# EAGLE design fab-slider-shield-v2_controls-only (EAGLE 9.2.0)
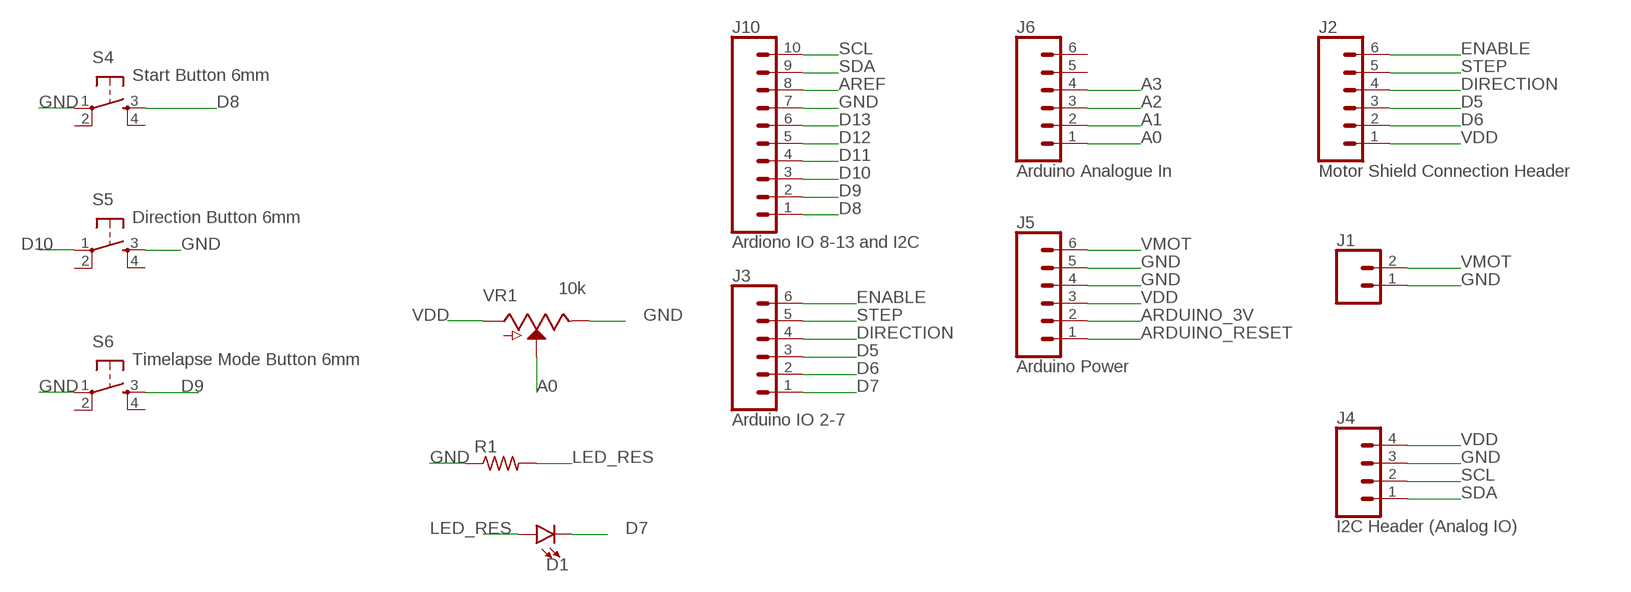
[diagram p0: schematic, sheet 1]

## Parts
D1  LED1206  [LED-1206]
J1  CONN_02PTH3  [1X02_LONGPADS]
J2  Motor Shield Connection Header  CONN_06LONGPADS  [1X06_LONGPADS]
J3  Arduino IO 2-7  CONN_06NO_SILK_FEMALE_PTH  [1X06_NO_SILK]
J4  I2C Header (Analog IO)  CONN_04  [1X04]
J5  Arduino Power  CONN_06NO_SILK_FEMALE_PTH  [1X06_NO_SILK]
J6  Arduino Analogue In  CONN_06NO_SILK_FEMALE_PTH  [1X06_NO_SILK]
J10  Ardiono IO 8-13 and I2C  CONN_10NO_SILK_PTH_FEMALE  [1X10_NO_SILK]
R1  RES-US1206FAB  [R1206FAB]
S4  Start Button 6mm  6MM_SWITCH6MM_SWITCH  [6MM_SWITCH]
S5  Direction Button 6mm  6MM_SWITCH6MM_SWITCH  [6MM_SWITCH]
S6  Timelapse Mode Button 6mm  6MM_SWITCH6MM_SWITCH  [6MM_SWITCH]
VR1  10k  POTENTIOMETER-PTH-9MM-1/20W-20%  [POT-PTH-ALPS]

## Nets
A0: J6.1 VR1.P$2(S)
A1: J6.2
A2: J6.3
A3: J6.4
ARDUINO_3V: J5.2
ARDUINO_RESET: J5.1
AREF: J10.8
D5: J2.3 J3.3
D6: J2.2 J3.2
D7: D1.C J3.1
D8: J10.1 S4.3(S)
D9: J10.2 S6.3(S)
D10: J10.3 S5.1(P)
D11: J10.4
D12: J10.5
D13: J10.6
DIRECTION: J2.4 J3.4
ENABLE: J2.6 J3.6
GND: J1.1 J4.3 J5.4 J5.5 J10.7 R1.1 S4.1(P) S5.3(S) S6.1(P) VR1.P$1(E)
LED_RES: D1.A R1.2
SCL: J4.2 J10.10
SDA: J4.1 J10.9
STEP: J2.5 J3.5
VDD: J2.1 J4.4 J5.3 VR1.P$3(A)
VMOT: J1.2 J5.6
Unconnected: J6.5 J6.6 S4.2(P1) S4.4(S1) S5.2(P1) S5.4(S1) S6.2(P1) S6.4(S1)

## Library data of the parts
D1 = SparkFun-LED:LED: LED (Generic) Standard schematic elements and footprints for 5mm, 3mm, 1206, and 0603 sized LEDs. Generic LEDs with no color specified.
J1 = SparkFun-Connectors:CONN_02: Multi connection point. Often used as Generic Header-pin footprint for 0.1 inch spaced/style header connections On any of the 0.1 inch spaced packages, you can populate with these: Break Away Headers - Straight <https://www.sparkfun.com/products/116> (PRT-00116) Break Away Male Headers - Right Angle <https://www.sparkfun.com/products/553> (PRT-00553) Female Headers <https://www.sparkfun.com/products/115> (PRT-00115) Break Away Headers - Machine Pin <https://www.sparkfun.com/products/117> (PRT-00117) Break Away Female Headers - Swiss Machine Pin <https://www.sparkfun.com/products/743> (PRT-00743) For SCREWTERMINALS and SPRING TERMINALS visit here: Screw Terimnals on SparkFun.com <https://www.sparkfun.com/search/results?term=Screw+Terminals> (5mm/3.5mm/2.54mm spacing) This device is also useful as a general connection point to wire up your design to another part of your project. Our various solder wires solder well into these plated through hole pads. Hook-Up Wire - Assortment (Stranded, 22 AWG) <https://www.sparkfun.com/products/11375> (PRT-11375) Hook-Up Wire - Assortment (Solid Core, 22 AWG) <https://www.sparkfun.com/products/11367> (PRT-11367) View the entire wire category on our website here <https://www.sparkfun.com/categories/141> Special notes: Molex polarized connector foot print use with: PRT-08233 with associated crimp pins and housings. 2.54_SCREWTERM for use with PRT-10571. 3.5mm Screw Terminal footprints for PRT-08084 5mm Screw Terminal footprints for use with PRT-08432
J2 = SparkFun-Connectors:CONN_06: Multi connection point. Often used as Generic Header-pin footprint for 0.1 inch spaced/style header connections On any of the 0.1 inch spaced packages, you can populate with these: Break Away Headers - Straight <https://www.sparkfun.com/products/116> (PRT-00116) Break Away Male Headers - Right Angle <https://www.sparkfun.com/products/553> (PRT-00553) Female Headers <https://www.sparkfun.com/products/115> (PRT-00115) Break Away Headers - Machine Pin <https://www.sparkfun.com/products/117> (PRT-00117) Break Away Female Headers - Swiss Machine Pin <https://www.sparkfun.com/products/743> (PRT-00743) Arduino Stackable Header - 6 Pin <https://www.sparkfun.com/products/9280> (PRT-09280) For SCREWTERMINALS and SPRING TERMINALS visit here: Screw Terimnals on SparkFun.com <https://www.sparkfun.com/search/results?term=Screw+Terminals> (5mm/3.5mm/2.54mm spacing) This device is also useful as a general connection point to wire up your design to another part of your project. Our various solder wires solder well into these plated through hole pads. Hook-Up Wire - Assortment (Stranded, 22 AWG) <https://www.sparkfun.com/products/11375> (PRT-11375) Hook-Up Wire - Assortment (Solid Core, 22 AWG) <https://www.sparkfun.com/products/11367> (PRT-11367) View the entire wire category on our website here <https://www.sparkfun.com/categories/141>
J3 J5 J6 = SparkFun-Connectors:CONN_06: Multi connection point. Often used as Generic Header-pin footprint for 0.1 inch spaced/style header connections On any of the 0.1 inch spaced packages, you can populate with these: Break Away Headers - Straight <https://www.sparkfun.com/products/116> (PRT-00116) Break Away Male Headers - Right Angle <https://www.sparkfun.com/products/553> (PRT-00553) Female Headers <https://www.sparkfun.com/products/115> (PRT-00115) Break Away Headers - Machine Pin <https://www.sparkfun.com/products/117> (PRT-00117) Break Away Female Headers - Swiss Machine Pin <https://www.sparkfun.com/products/743> (PRT-00743) Arduino Stackable Header - 6 Pin <https://www.sparkfun.com/products/9280> (PRT-09280) For SCREWTERMINALS and SPRING TERMINALS visit here: Screw Terimnals on SparkFun.com <https://www.sparkfun.com/search/results?term=Screw+Terminals> (5mm/3.5mm/2.54mm spacing) This device is also useful as a general connection point to wire up your design to another part of your project. Our various solder wires solder well into these plated through hole pads. Hook-Up Wire - Assortment (Stranded, 22 AWG) <https://www.sparkfun.com/products/11375> (PRT-11375) Hook-Up Wire - Assortment (Solid Core, 22 AWG) <https://www.sparkfun.com/products/11367> (PRT-11367) View the entire wire category on our website here <https://www.sparkfun.com/categories/141>; PROD_ID: CONN-08437
J4 = SparkFun-Connectors:CONN_04: Multi connection point. Often used as Generic Header-pin footprint for 0.1 inch spaced/style header connections On any of the 0.1 inch spaced packages, you can populate with these: Break Away Headers - Straight <https://www.sparkfun.com/products/116> (PRT-00116) Break Away Male Headers - Right Angle <https://www.sparkfun.com/products/553> (PRT-00553) Female Headers <https://www.sparkfun.com/products/115> (PRT-00115) Break Away Headers - Machine Pin <https://www.sparkfun.com/products/117> (PRT-00117) Break Away Female Headers - Swiss Machine Pin <https://www.sparkfun.com/products/743> (PRT-00743) For SCREWTERMINALS and SPRING TERMINALS visit here: Screw Terimnals on SparkFun.com <https://www.sparkfun.com/search/results?term=Screw+Terminals> (5mm/3.5mm/2.54mm spacing) This device is also useful as a general connection point to wire up your design to another part of your project. Our various solder wires solder well into these plated through hole pads. Hook-Up Wire - Assortment (Stranded, 22 AWG) <https://www.sparkfun.com/products/11375> (PRT-11375) Hook-Up Wire - Assortment (Solid Core, 22 AWG) <https://www.sparkfun.com/products/11367> (PRT-11367) View the entire wire category on our website here <https://www.sparkfun.com/categories/141> Special notes: Molex polarized connector foot print use with SKU : PRT-08231 with associated crimp pins and housings. 1MM SMD Version SKU: PRT-10208; PROD_ID: CONN-09696
J10 = SparkFun-Connectors:CONN_10: Multi connection point. Often used as Generic Header-pin footprint for 0.1 inch spaced/style header connections On any of the 0.1 inch spaced packages, you can populate with these: Break Away Headers - Straight <https://www.sparkfun.com/products/116> (PRT-00116) Break Away Male Headers - Right Angle <https://www.sparkfun.com/products/553> (PRT-00553) Female Headers <https://www.sparkfun.com/products/115> (PRT-00115) Break Away Headers - Machine Pin <https://www.sparkfun.com/products/117> (PRT-00117) Break Away Female Headers - Swiss Machine Pin <https://www.sparkfun.com/products/743> (PRT-00743) Arduino Stackable Header - 10 Pin <https://www.sparkfun.com/products/11376> (PRT-11376) For SCREWTERMINALS and SPRING TERMINALS visit here: Screw Terimnals on SparkFun.com <https://www.sparkfun.com/search/results?term=Screw+Terminals> (5mm/3.5mm/2.54mm spacing) This device is also useful as a general connection point to wire up your design to another part of your project. Our various solder wires solder well into these plated through hole pads. Hook-Up Wire - Assortment (Stranded, 22 AWG) <https://www.sparkfun.com/products/11375> (PRT-11375) Hook-Up Wire - Assortment (Solid Core, 22 AWG) <https://www.sparkfun.com/products/11367> (PRT-11367) View the entire wire category on our website here <https://www.sparkfun.com/categories/141> Special notes: Molex polarized connector foot print use with SKU : PRT-08231 with associated crimp pins and housings. 1MM SMD Version SKU: PRT-10208 NOTES ON THE VARIANTS LOCK and LOCK_LONGPADS... This footprint was designed to help hold the alignment of a through-hole component (i.e. 6-pin header) while soldering it into place. You may notice that each hole has been shifted either up or down by 0.005 of an inch from it's more standard position (which is a perfectly straight line). This slight alteration caused the pins (the squares in the middle) to touch the edges of the holes. Because they are alternating, it causes a "brace" to hold the component in place. 0.005 has proven to be the perfect amount of "off-center" position when using our standard breakaway headers. Although looks a little odd when you look at the bare footprint, once you have a header in there, the alteration is very hard to notice. Also,if you push a header all the way into place, it is covered up entirely on the bottom side.; PROD_ID: CONN-11563
R1 = fab:RES-US: Resistor (US Symbol) Variants with postfix FAB are widened to allow the routing of internal traces
S4-S6 = fab:6MM_SWITCH: OMRON SWITCH
VR1 = SparkFun-Resistors:POTENTIOMETER: Potentiometer (Pot) Three-terminal potentiometers, with an adjustable wiper and two adjustable resistors. A pot can be used to create a configurable voltage divider, or as a variable resistor. Variants ALPS_POT and ALPS_POT_KIT - PTH, breadboard compatible, 9mm square pots Rotary Potentiometer - Linear (10k ohm) <https://www.sparkfun.com/products/9288> (COM-09288) The KIT variant exposes copper on only one side of the PTH pad, so the part can only be assembled on one side of the PCB. Useful for beginner soldering kits.; PROD_ID: RES-09177; SF_SKU: COM-09288

## Board
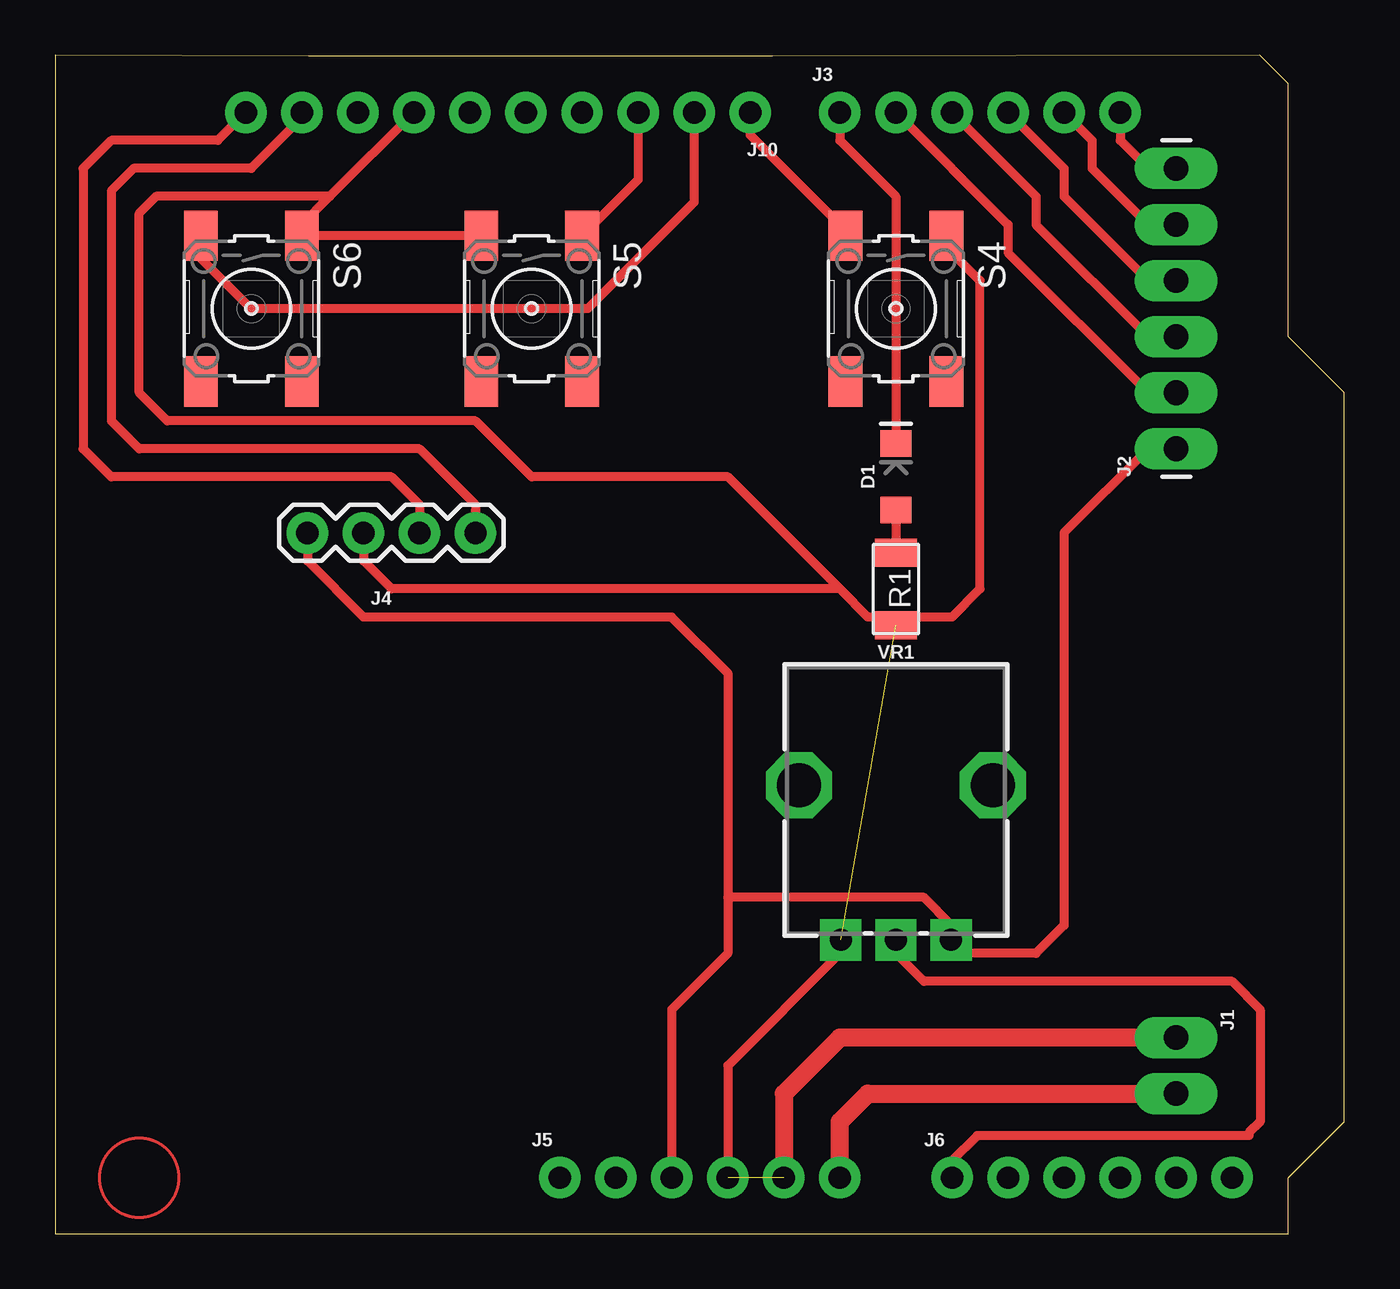
[diagram p1: board, top side]

Size 58.42 x 53.39 mm. Coordinates in mm from the lower left corner, seen from the top.
Outline: 0,0 55.88,0 55.88,2.54 58.42,5.08 58.42,38.1 55.88,40.64 55.88,52.1 54.59,53.39 32.51,53.34 11.48,53.34 0,53.39 0,0
Copper layers (1*16): Top 0.035mm / dielectric 1.5mm / Bottom 0.035mm
Design rules "default": minimum track width 6mil, minimum drill 0.35mm, track to track 6mil, track to pad 6mil, pad to pad 6mil, via to via 6mil, smd to smd 6mil, copper to edge 40mil, drill to drill 6mil, minimum pad ring 10mil, minimum via ring 8mil, stop-mask expansion 4mil, vias tented up to drill 0mil, thermal gap 10mil

### Footprints (pad centres in the part's own frame; a part is rotated, then mirrored left to right if it is on the bottom)
LED-1206 = smd 1.2 x 1.4: A -1.5,0; C 1.5,0
1X02_LONGPADS = drill 1.118 pad 1.88 long: 1 0,0; 2 2.54,0
1X06_LONGPADS = drill 1.118 pad 1.88 long: 1 0,0; 2 2.54,0; 3 5.08,0; 4 7.62,0; 5 10.16,0; 6 12.7,0
1X06_NO_SILK = drill 1.016 pad 1.88: 1 0,0; 2 2.54,0; 3 5.08,0; 4 7.62,0; 5 10.16,0; 6 12.7,0
1X04 = drill 1.016 pad 1.88: 1 0,0; 2 2.54,0; 3 5.08,0; 4 7.62,0
1X10_NO_SILK = drill 1.016 pad 1.88: 1 0,0; 2 2.54,0; 3 5.08,0; 4 7.62,0; 5 10.16,0; 6 12.7,0; 7 15.24,0; 8 17.78,0; 9 20.32,0; 10 22.86,0
R1206FAB = smd 1.27 x 1.905: 1 -1.651,0; 2 1.651,0
6MM_SWITCH = smd 2.286 x 1.524: 1 -3.302,2.286; 2 3.302,2.286; 3 -3.302,-2.286; 4 3.302,-2.286
POT-PTH-ALPS = drill 1 pad 1.88 square: P$1 7,-2.5; P$2 7,0; P$3 7,2.5 | drill 2 octagon: P$4 0,-4.4; P$5 0,4.4

### Placement (x,y rotation side)
D1  38.1,34.29 90 top
J1  50.8,8.89 270 top
J2  50.8,35.56 90 top
J3  35.56,50.8 0 top
J4  19.05,31.75 180 top
J5  22.86,2.54 0 top
J6  40.64,2.54 0 top
J10  31.5,50.8 180 top
R1  38.1,29.21 90 top
S4  38.1,41.91 270 top
S5  21.59,41.91 270 top
S6  8.89,41.91 270 top
VR1  38.1,20.32 270 top

### Tracks (layer width: path | path; a pad name or v marks a point on that pad's centre or on a via)
A0
  Top 0.406: J6.1 40.64,3.3 41.78,4.45 54.1,4.45 54.1,4.57 54.61,5.08 54.61,10.16 53.34,11.43 39.37,11.43 38.1,12.7 VR1.P$2
D5
  Top 0.406: J3.3 44.45,46.99 44.45,45.72 49.53,40.64 J2.3
D6
  Top 0.406: J3.2 43.18,45.72 43.18,44.45 49.53,38.1 J2.2
D7
  Top 0.406: J3.1 35.56,49.53 38.1,46.99 D1.C
D8
  Top 0.406: J10.1 31.5,49.78 35.81,45.47 S4.3
D9
  Top 0.406: J10.2 28.96,46.74 24.13,41.91 8.89,41.91 6.6,44.2 S6.3
D10
  Top 0.406: J10.3 26.42,47.75 S5.1
DIRECTION
  Top 0.406: J2.4 49.53,43.18 45.72,46.99 45.72,48.26 J3.4
ENABLE
  Top 0.406: J3.6 48.26,49.53 49.53,48.26 J2.6
GND  (2 unrouted)
  Top 0.406: J4.3 13.97,30.48 15.24,29.21 35.56,29.21 | J5.4 30.48,7.62 35.56,12.7 35.56,13.28 VR1.P$1 | 12.45,46.99 4.57,46.99 3.81,46.23 3.81,38.1 5.08,36.83 19.05,36.83 21.59,34.29 30.48,34.29 35.56,29.21 | 35.56,29.21 36.83,27.94 37.72,27.94 R1.1 38.48,27.94 40.64,27.94 41.91,29.21 41.91,43.18 40.64,44.45 40.64,44.96 S4.1 | 12.45,46.99 J10.7 | S5.3 S6.1 11.18,45.72 12.45,46.99
  Top 0.813: J5.5 33.02,6.35 35.56,8.89 J1.1
LED_RES
  Top 0.406: D1.A R1.2
SCL
  Top 0.406: J10.10 7.37,49.53 2.54,49.53 1.27,48.26 1.27,35.56 2.54,34.29 15.24,34.29 16.51,33.02 J4.2
SDA
  Top 0.406: 19.05,32.77 J4.1 19.05,33.02 16.51,35.56 3.81,35.56 2.54,36.83 2.54,47.24 3.56,48.26 8.89,48.26 11.18,50.55 J10.9
STEP
  Top 0.406: J2.5 49.53,45.72 46.99,48.26 46.99,49.53 J3.5
VDD
  Top 0.406: J5.3 27.94,10.16 30.48,12.7 30.48,15.24 | J2.1 49.53,35.56 45.72,31.75 45.72,13.97 44.45,12.7 41.22,12.7 VR1.P$3 40.6,14.01 39.37,15.24 30.48,15.24 | J4.4 11.43,30.48 13.97,27.94 27.94,27.94 30.48,25.4 30.48,15.24
VMOT
  Top 0.813: J5.6 35.56,5.08 36.83,6.35 J1.2
(copper drawn outside any net)
  shapes: Top circle x1